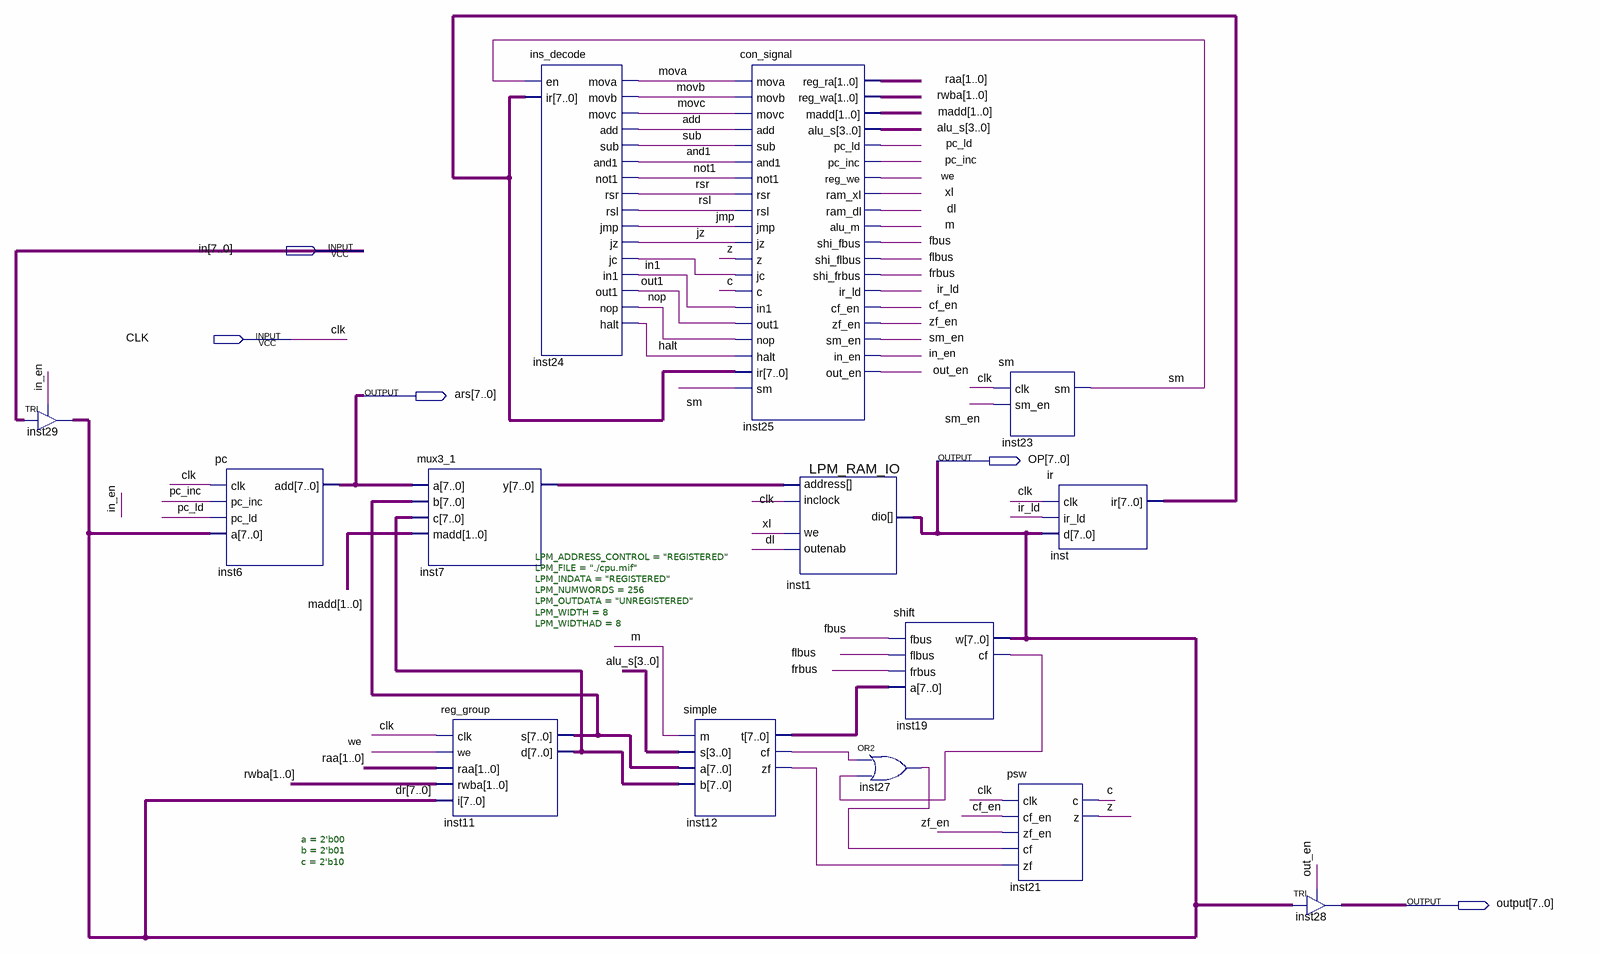
[diagram p0: schematic sheet]
// Quartus schematic cpu.bdf as structural Verilog: 14 symbols, 5 pins
module cpu (
  input  [7:0] in,
  input  CLK,
  output [7:0] ars,
  output [7:0] OP,
  output [7:0] \output 
);

  wire add, and1, c, cf_en, dl, fbus, flbus, frbus, halt, in_en, inst12_cf, inst12_zf, inst19_cf, inst24_jc,
       inst27_out, ir_ld, jmp, jz, m, mova, movb, movc, nop, not1, out1, out_en, pc_inc, pc_ld, rsl, rsr, sm,
       sm_en, sub, we, xl, z, zf_en;
  wire [1:0] madd, raa, rwba;
  wire [3:0] alu_s;
  wire [7:0] inst7_y, inst11_d, inst11_s, inst12_t, inst_ir;

  TRI inst29[7:0] (.IN(in), .OE(in_en), .OUT(OP));
  pc inst6 (.clk(CLK), .pc_inc(pc_inc), .pc_ld(pc_ld), .a(OP), .add(ars));
  mux3_1 inst7 (.a(ars), .b(inst11_s), .c(inst11_d), .madd(madd), .y(inst7_y));
  reg_group #(.a(2'b00), .b(2'b01), .c(2'b10)) inst11 (
    .clk(CLK), .we(we), .raa(raa), .rwba(rwba), .i(OP), .s(inst11_s), .d(inst11_d));
  ins_decode inst24 (
    .en(sm), .ir(inst_ir), .mova(mova), .movb(movb), .movc(movc), .add(add), .sub(sub), .and1(and1),
    .not1(not1), .rsr(rsr), .rsl(rsl), .jmp(jmp), .jz(jz), .jc(inst24_jc), .in1(in[1]), .out1(out1),
    .nop(nop), .halt(halt));
  simple inst12 (.m(m), .s(alu_s), .a(inst11_s), .b(inst11_d), .t(inst12_t), .cf(inst12_cf), .zf(inst12_zf));
  con_signal inst25 (
    .mova(mova), .movb(movb), .movc(movc), .add(add), .sub(sub), .and1(and1), .not1(not1), .rsr(rsr),
    .rsl(rsl), .jmp(jmp), .jz(jz), .z(z), .jc(inst24_jc), .c(c), .in1(in[1]), .out1(out1), .nop(nop),
    .halt(halt), .ir(inst_ir), .sm(sm), .reg_ra(raa), .reg_wa(rwba), .madd(madd), .alu_s(alu_s),
    .pc_ld(pc_ld), .pc_inc(pc_inc), .reg_we(we), .ram_xl(xl), .ram_dl(dl), .alu_m(m), .shi_fbus(fbus),
    .shi_flbus(flbus), .shi_frbus(frbus), .ir_ld(ir_ld), .cf_en(cf_en), .zf_en(zf_en), .sm_en(sm_en),
    .in_en(in_en), .out_en(out_en));
  LPM_RAM_IO #(.LPM_ADDRESS_CONTROL("REGISTERED"), .LPM_FILE("./cpu.mif"), .LPM_INDATA("REGISTERED"), .LPM_NUMWORDS(256), .LPM_OUTDATA("UNREGISTERED"), .LPM_WIDTH(8), .LPM_WIDTHAD(8)) inst1 (
    .address(inst7_y), .inclock(CLK), .we(xl), .outenab(dl), .dio(OP));
  shift inst19 (.fbus(fbus), .flbus(flbus), .frbus(frbus), .a(inst12_t), .w(OP), .cf(inst19_cf));
  or inst27 (inst27_out, inst12_cf, inst19_cf);
  sm inst23 (.clk(CLK), .sm_en(sm_en), .sm(sm));
  psw inst21 (.clk(CLK), .cf_en(cf_en), .zf_en(zf_en), .cf(inst27_out), .zf(inst12_zf), .c(c), .z(z));
  ir inst (.clk(CLK), .ir_ld(ir_ld), .d(OP), .ir(inst_ir));
  TRI inst28[7:0] (.IN(OP), .OE(out_en), .OUT(\output ));

  // Other names for the same wires on the sheet: dr[7:0] = OP
endmodule
